# EAGLE design i2c_multiplexer_shield_v1 (EAGLE 6.5.0)
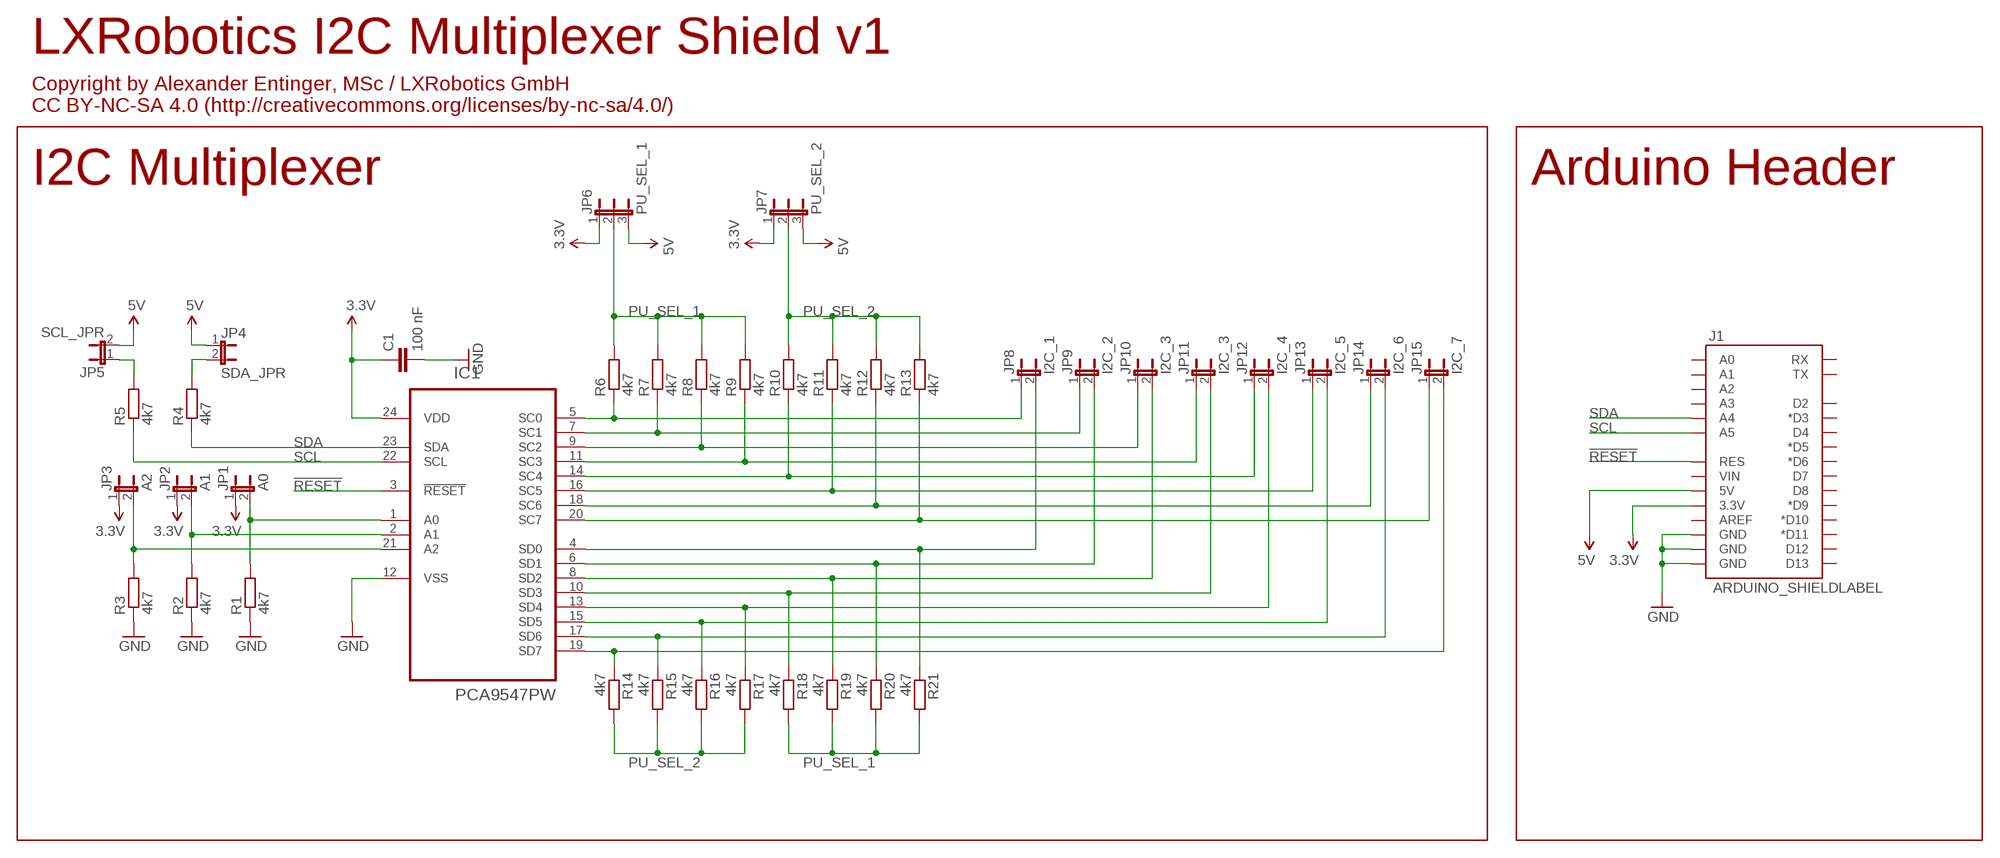
[diagram p0: schematic, sheet 1]

## Parts
C1  100 nF  C-EUC0805  [C0805]
IC1  PCA9547PW  [SOP65P640X110-24N]
J1  ARDUINO_SHIELDLABEL  [DUEMILANOVE_SHIELD]
JP1  A0  JP1E  [JP1]
JP2  A1  JP1E  [JP1]
JP3  A2  JP1E  [JP1]
JP4  SDA_JPR  JP1E  [JP1]
JP5  SCL_JPR  JP1E  [JP1]
JP6  PU_SEL_1  JP2E  [JP2]
JP7  PU_SEL_2  JP2E  [JP2]
JP8  I2C_1  JP1E  [JP1]
JP9  I2C_2  JP1E  [JP1]
JP10  I2C_3  JP1E  [JP1]
JP11  I2C_3  JP1E  [JP1]
JP12  I2C_4  JP1E  [JP1]
JP13  I2C_5  JP1E  [JP1]
JP14  I2C_6  JP1E  [JP1]
JP15  I2C_7  JP1E  [JP1]
R1  4k7  R-EU_R0805  [R0805]
R2  4k7  R-EU_R0805  [R0805]
R3  4k7  R-EU_R0805  [R0805]
R4  4k7  R-EU_R0805  [R0805]
R5  4k7  R-EU_R0805  [R0805]
R6  4k7  R-EU_R0805  [R0805]
R7  4k7  R-EU_R0805  [R0805]
R8  4k7  R-EU_R0805  [R0805]
R9  4k7  R-EU_R0805  [R0805]
R10  4k7  R-EU_R0805  [R0805]
R11  4k7  R-EU_R0805  [R0805]
R12  4k7  R-EU_R0805  [R0805]
R13  4k7  R-EU_R0805  [R0805]
R14  4k7  R-EU_R0805  [R0805]
R15  4k7  R-EU_R0805  [R0805]
R16  4k7  R-EU_R0805  [R0805]
R17  4k7  R-EU_R0805  [R0805]
R18  4k7  R-EU_R0805  [R0805]
R19  4k7  R-EU_R0805  [R0805]
R20  4k7  R-EU_R0805  [R0805]
R21  4k7  R-EU_R0805  [R0805]

## Nets
3.3V: C1.1 IC1.24(VDD) J1.3.3V JP1.1 JP2.1 JP3.1 JP6.1 JP7.1
5V: J1.5V JP4.1 JP5.2 JP6.3 JP7.3
!RESET: IC1.3(!RESET) J1.RES
GND: C1.2 IC1.12(VSS) J1.GND@0(GND) J1.GND@1(GND) J1.GND@2(GND) R1.1 R2.1 R3.1
N$1: IC1.1(A0) JP1.2 R1.2
N$2: IC1.2(A1) JP2.2 R2.2
N$3: IC1.21(A2) JP3.2 R3.2
N$4: JP5.1 R5.2
N$5: JP4.2 R4.2
N$6: IC1.5(SC0) JP8.1 R6.1
N$7: IC1.7(SC1) JP9.1 R7.1
N$8: IC1.9(SC2) JP10.1 R8.1
N$9: IC1.11(SC3) JP11.1 R9.1
N$10: IC1.14(SC4) JP12.1 R10.1
N$11: IC1.16(SC5) JP13.1 R11.1
N$12: IC1.18(SC6) JP14.1 R12.1
N$13: IC1.20(SC7) JP15.1 R13.1
N$16: IC1.4(SD0) JP8.2 R21.1
N$17: IC1.6(SD1) JP9.2 R20.1
N$18: IC1.8(SD2) JP10.2 R19.1
N$19: IC1.10(SD3) JP11.2 R18.1
N$20: IC1.13(SD4) JP12.2 R17.1
N$21: IC1.15(SD5) JP13.2 R16.1
N$22: IC1.17(SD6) JP14.2 R15.1
N$23: IC1.19(SD7) JP15.2 R14.1
PU_SEL_1: JP6.2 R6.2 R7.2 R8.2 R9.2 R18.2 R19.2 R20.2 R21.2
PU_SEL_2: JP7.2 R10.2 R11.2 R12.2 R13.2 R14.2 R15.2 R16.2 R17.2
SCL: IC1.22(SCL) J1.A5 R5.1
SDA: IC1.23(SDA) J1.A4 R4.1
Unconnected: J1.A0 J1.A1 J1.A2 J1.A3 J1.AREF J1.D2 J1.D3(*D3) J1.D4 J1.D5(*D5) J1.D6(*D6) J1.D7 J1.D8 J1.D9(*D9) J1.D10(*D10) J1.D11(*D11) J1.D12 J1.D13 J1.RX J1.TX J1.VIN

## Notes on the sheet
- LXRobotics I2C Multiplexer Shield v1
- Copyright by Alexander Entinger, MSc / LXRobotics GmbH 
  CC BY-NC-SA 4.0 (http://creativecommons.org/licenses/by-nc-sa/4.0/)
- I2C Multiplexer | Arduino Header

## Library data of the parts
C1 = resistor:C-EU: CAPACITOR, European symbol
IC1 = lxrobotics_ic:PCA9547PW: IC, 8-channel I2C-bus multiplexer with reset, 16TSSOP; MPN: PCA9547PW; OC_FARNELL: 2212121; OC_NEWARK: 55W4321; PACKAGE: TSSOP-24; SUPPLIER: NXP
J1 = SparkFun-Boards:ARDUINO_SHIELD: Arduino shield footprint
JP1-JP5 JP8-JP15 = jumper:JP1E: JUMPER
JP6 JP7 = jumper:JP2E: JUMPER
R1-R21 = resistor:R-EU_: RESISTOR, European symbol

## Board
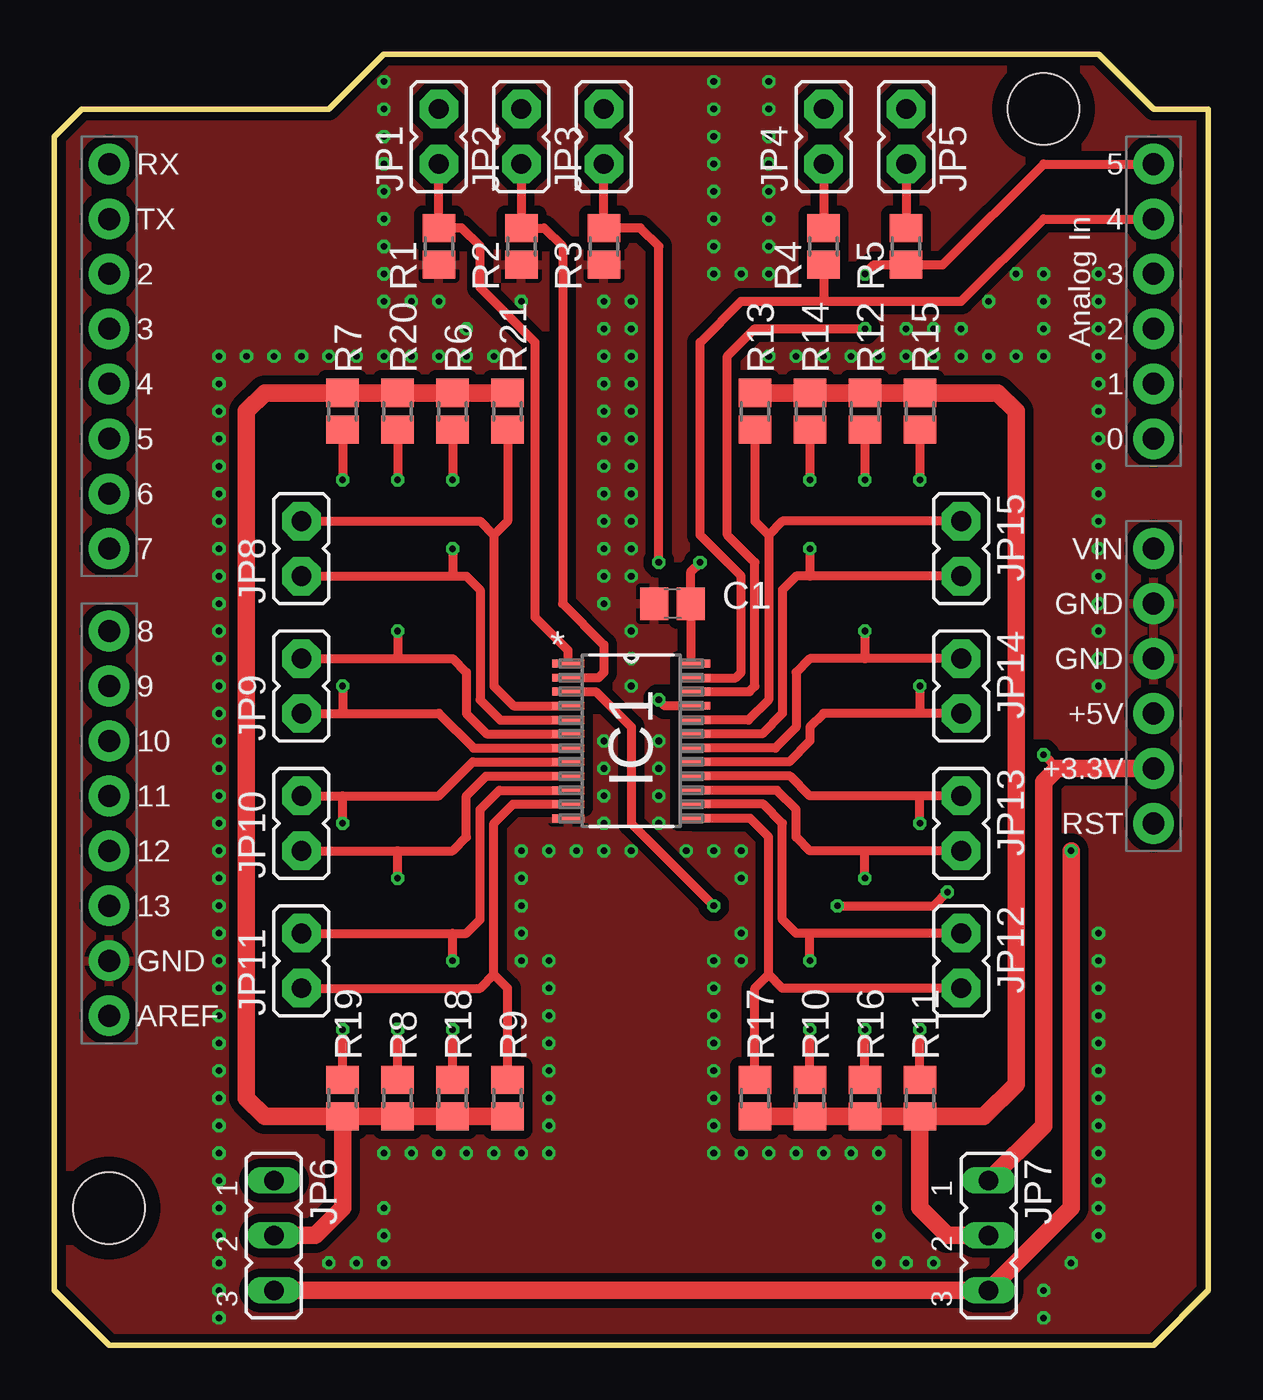
[diagram p1: board, top side]
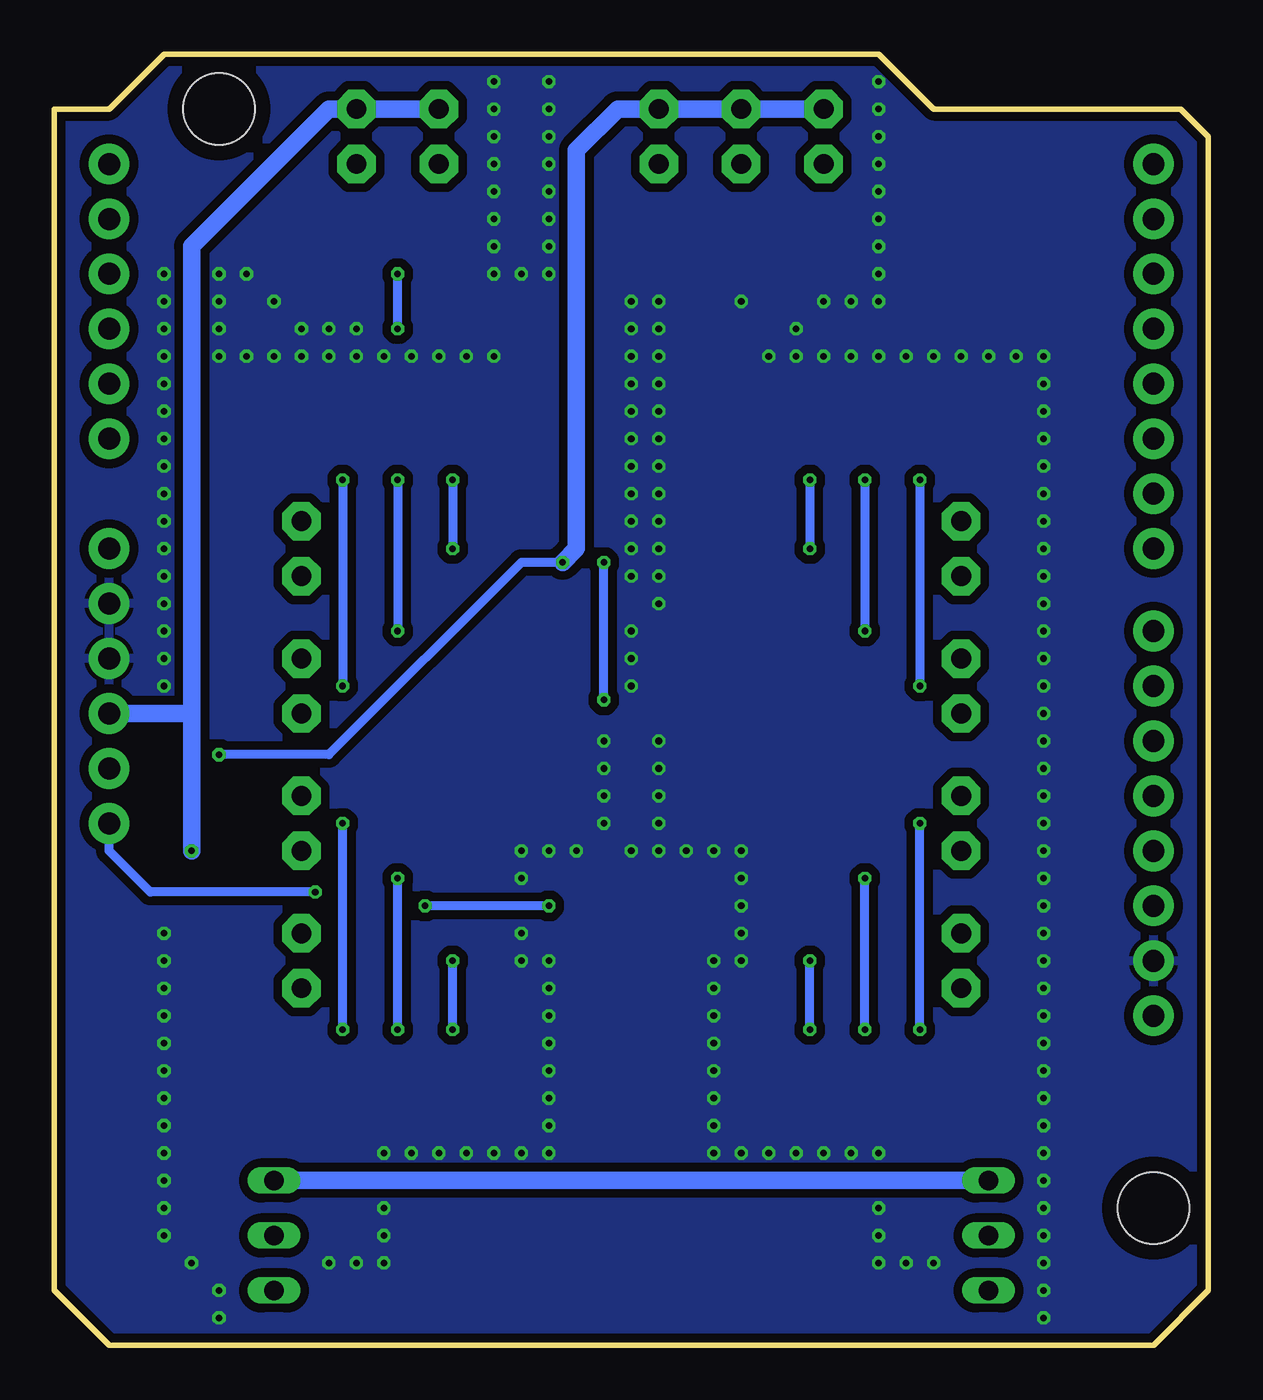
[diagram p2: board, bottom side, seen from below]

Size 53.34 x 59.69 mm. Coordinates in mm from the lower left corner, seen from the top.
Outline: 0,2.54 2.54,0 50.8,0 53.34,2.54 53.34,57.15 50.8,57.15 48.26,59.69 15.24,59.69 12.7,57.15 1.27,57.15 0,55.88 0,2.54
Copper layers (1*16): Top 0.035mm / dielectric 1.5mm / Bottom 0.035mm
Design rules "LeitOn - Standard-Eagle-DRU - 1- und  2-Lagen DK - deutsch - Rev 2.0": minimum track width 0.15mm, minimum drill 0.3mm, track to track 0.15mm, track to pad 0.15mm, pad to pad 0.15mm, via to via 0.15mm, smd to smd 0.15mm, copper to edge 0.3mm, drill to drill 0.3mm, minimum pad ring 0.15mm, minimum via ring 0.15mm, stop-mask expansion 0.075mm, vias tented up to drill 0mil, thermal gap 0.2mm

### Footprints (pad centres in the part's own frame; a part is rotated, then mirrored left to right if it is on the bottom)
C0805 = smd 1.3 x 1.5: 1 -0.85,0; 2 0.85,0
SOP65P640X110-24N = smd 1.473 x 0.356: 1 -2.921,3.581; 2 -2.921,2.921; 3 -2.921,2.286; 4 -2.921,1.626; 5 -2.921,0.965; 6 -2.921,0.33; 7 -2.921,-0.33; 8 -2.921,-0.965; 9 -2.921,-1.626; 10 -2.921,-2.286; 11 -2.921,-2.921; 12 -2.921,-3.581; 13 2.921,-3.581; 14 2.921,-2.921; 15 2.921,-2.286; 16 2.921,-1.626; 17 2.921,-0.965; 18 2.921,-0.33; 19 2.921,0.33; 20 2.921,0.965; 21 2.921,1.626; 22 2.921,2.286; 23 2.921,2.921; 24 2.921,3.581
DUEMILANOVE_SHIELD = drill 1.016 pad 1.88: 3.3V 50.8,26.67; 5V 50.8,29.21; A0 50.8,41.91; A1 50.8,44.45; A2 50.8,46.99; A3 50.8,49.53; A4 50.8,52.07; A5 50.8,54.61; AREF 2.54,15.24; D2 2.54,49.53; D3 2.54,46.99; D4 2.54,44.45; D5 2.54,41.91; D6 2.54,39.37; D7 2.54,36.83; D8 2.54,33.02; D9 2.54,30.48; D10 2.54,27.94; D11 2.54,25.4; D12 2.54,22.86; D13 2.54,20.32; GND@0 50.8,31.75; GND@1 50.8,34.29; GND@2 2.54,17.78; RES 50.8,24.13; RX 2.54,54.61; TX 2.54,52.07; VIN 50.8,36.83 | hole 3.302: 45.72,57.15; 2.54,6.35
JP1 = drill 0.914 pad 1.778 octagon: 1 0,-1.27; 2 0,1.27
JP2 = drill 0.914 long: 1 -2.54,0; 2 0,0; 3 2.54,0
R0805 = smd 1.3 x 1.5: 1 -0.85,0; 2 0.85,0

### Placement (x,y rotation side)
C1  28.57,34.29 180 top
IC1  26.67,27.94 0 top
J1  0,0 0 top
JP1  17.78,55.88 180 top
JP2  21.59,55.88 180 top
JP3  25.4,55.88 180 top
JP4  35.56,55.88 180 top
JP5  39.37,55.88 0 top
JP6  10.16,5.08 270 top
JP7  43.18,5.08 270 top
JP8  11.43,36.83 0 top
JP9  11.43,30.48 0 top
JP10  11.43,24.13 0 top
JP11  11.43,17.78 0 top
JP12  41.91,17.78 180 top
JP13  41.91,24.13 180 top
JP14  41.91,30.48 180 top
JP15  41.91,36.83 180 top
R1  17.78,50.8 90 top
R2  21.59,50.8 90 top
R3  25.4,50.8 90 top
R4  35.56,50.8 90 top
R5  39.37,50.8 90 top
R6  18.41,43.18 90 top
R7  13.34,43.18 90 top
R8  15.88,11.43 270 top
R9  20.95,11.43 270 top
R10  34.92,11.43 270 top
R11  40.01,11.43 270 top
R12  37.47,43.18 90 top
R13  32.38,43.18 90 top
R14  34.92,43.18 90 top
R15  40.01,43.18 90 top
R16  37.47,11.43 270 top
R17  32.38,11.43 270 top
R18  18.41,11.43 270 top
R19  13.34,11.43 270 top
R20  15.88,43.18 90 top
R21  20.95,43.18 90 top

### Tracks (layer width: path | path; a pad name or v marks a point on that pad's centre or on a via)
3.3V  (via drill 0.3)
  Top 0.406: v45.72,27.3 46.35,26.67 | IC1.24 29.43,31.52 C1.1 29.43,35.77 v29.84,36.2
  Top 0.813: J1.3.3V 46.35,26.67 45.72,26.04 45.72,10.16 JP7.1
  Bottom 0.406: v45.72,27.3 40.64,27.3 31.75,36.2 v29.84,36.2
  Bottom 0.813: JP6.1 JP7.1 | JP1.1 JP2.1 JP3.1 27.3,57.15 29.21,55.24 29.21,36.83 v29.84,36.2
5V  (via drill 0.3)
  Top 0.813: JP6.3 JP7.3 46.99,6.35 v46.99,22.86
  Bottom 0.813: JP5.2 JP4.1 40.64,57.15 46.99,50.8 46.99,29.21 | 46.99,29.21 J1.5V | 46.99,29.21 v46.99,22.86
!RESET  (via drill 0.3)
  Top 0.406: IC1.3 25.02,30.23 26.67,28.57 26.67,24.13 v30.48,20.32 | v36.2,20.32 40.64,20.32 v41.27,20.95
  Bottom 0.406: v30.48,20.32 v36.2,20.32 | v41.27,20.95 48.9,20.95 50.8,22.86 J1.RES
GND  (via drill 0.3)
  other vias: 21.59,22.86 22.86,22.86 24.13,22.86 25.4,22.86 26.67,22.86 29.21,22.86 30.48,22.86 31.75,22.86 31.75,21.59 21.59,21.59 21.59,20.32 21.59,19.05 21.59,17.78 22.86,17.78 22.86,15.24 22.86,16.51 22.86,13.97 22.86,12.7 22.86,11.43 22.86,10.16 22.86,8.89 31.75,19.05 31.75,17.78 30.48,17.78 30.48,16.51 30.48,15.24 30.48,13.97 30.48,12.7 30.48,11.43 30.48,10.16 30.48,8.89 25.4,25.4 25.4,24.13 25.4,26.67 25.4,27.94 27.94,27.94 27.94,26.67 27.94,25.4 27.94,24.13 26.67,30.48 26.67,31.75 26.67,33.02 25.4,34.29 25.4,35.56 25.4,36.83 25.4,38.1 26.67,38.1 26.67,36.83 26.67,35.56 26.67,39.37 25.4,39.37 25.4,40.64 26.67,40.64 26.67,41.91 25.4,41.91 25.4,43.18 25.4,44.45 25.4,45.72 26.67,45.72 26.67,44.45 26.67,43.18 26.67,46.99 25.4,46.99 25.4,48.26 26.67,48.26 21.59,48.26 20.32,45.72 19.05,46.99 17.78,48.26 16.51,48.26 15.24,48.26 15.24,49.53 15.24,50.8 15.24,52.07 15.24,53.34 15.24,54.61 15.24,55.88 15.24,57.15 15.24,58.42 19.05,45.72 13.97,45.72 17.78,45.72 16.51,45.72 15.24,45.72 12.7,45.72 11.43,45.72 10.16,45.72 8.89,45.72 7.62,45.72 7.62,44.45 7.62,43.18 7.62,41.91 7.62,40.64 7.62,39.37 7.62,38.1 7.62,36.83 7.62,35.56 7.62,34.29 7.62,33.02 7.62,31.75 7.62,30.48 7.62,29.21 7.62,27.94 7.62,26.67 7.62,25.4 7.62,24.13 7.62,22.86 7.62,21.59 7.62,20.32 7.62,19.05 7.62,17.78 7.62,16.51 7.62,15.24 7.62,13.97 7.62,12.7 7.62,11.43 7.62,10.16 7.62,8.89 7.62,7.62 7.62,6.35 7.62,5.08 7.62,3.81 7.62,2.54 7.62,1.27 30.48,58.42 30.48,57.15 30.48,55.88 30.48,54.61 30.48,53.34 30.48,52.07 30.48,50.8 30.48,49.53 31.75,49.53 33.02,49.53 33.02,50.8 33.02,52.07 33.02,53.34 33.02,54.61 33.02,55.88 33.02,57.15 33.02,58.42 39.37,46.99 40.64,46.99 41.91,46.99 43.18,48.26 44.45,49.53 45.72,49.53 45.72,48.26 45.72,46.99 45.72,45.72 44.45,45.72 43.18,45.72 41.91,45.72 40.64,45.72 39.37,45.72 38.1,45.72 36.83,45.72 35.56,45.72 34.29,45.72 33.02,45.72 21.59,8.89 20.32,8.89 19.05,8.89 17.78,8.89 16.51,8.89 15.24,8.89 31.75,8.89 33.02,8.89 34.29,8.89 35.56,8.89 36.83,8.89 38.1,8.89 48.26,49.53 48.26,48.26 48.26,46.99 48.26,45.72 48.26,44.45 48.26,43.18 48.26,41.91 48.26,40.64 48.26,39.37 48.26,38.1 48.26,36.83 48.26,35.56 48.26,34.29 48.26,33.02 48.26,31.75 48.26,30.48 48.26,19.05 48.26,17.78 48.26,16.51 48.26,15.24 48.26,13.97 48.26,12.7 48.26,11.43 48.26,10.16 48.26,8.89 48.26,7.62 48.26,6.35 48.26,5.08 46.99,3.81 45.72,2.54 45.72,1.27 15.24,6.35 15.24,5.08 15.24,3.81 38.1,6.35 38.1,5.08 38.1,3.81 39.37,3.81 13.97,3.81 12.7,3.81 40.64,3.81
  pour Bottom (isolate 0.406): 0.64,2.54 2.54,0.64 50.8,0.64 52.7,2.54 52.7,56.52 50.8,56.52 48.26,59.05 15.24,59.05 12.7,56.52 1.27,56.52 0.64,55.88
  pour Top (isolate 0.406): 0.64,2.54 2.54,0.64 50.8,0.64 52.7,2.54 52.7,56.52 50.8,56.52 48.26,59.05 15.24,59.05 12.7,56.52 1.27,56.52 0.64,55.88
N$1
  Top 0.406: JP1.2 R1.2 18.84,51.65 19.68,50.8 19.68,48.9 22.23,46.35 22.23,33.66 23.75,32.13 IC1.1
N$2
  Top 0.406: JP2.2 R2.2 22.64,51.65 23.5,50.8 23.5,34.29 25.4,32.38 25.4,31.11 25.15,30.86 IC1.2
N$3  (via drill 0.3)
  Top 0.406: JP3.2 R3.2 27.09,51.65 27.94,50.8 v27.94,36.2 | IC1.21 28.22,29.57 v27.94,29.84
  Bottom 0.406: v27.94,29.84 v27.94,36.2
N$4
  Top 0.406: JP5.1 R5.2
N$5
  Top 0.406: JP4.2 R4.2
N$6  (via drill 0.3)
  Top 0.406: JP8.1 18.41,35.56 | 18.41,35.56 19.05,35.56 19.68,34.92 19.68,29.84 20.62,28.91 IC1.5 | R6.1 v18.41,40.01 | v18.41,36.83 18.41,35.56
  Bottom 0.406: v18.41,40.01 v18.41,36.83
N$7  (via drill 0.3)
  Top 0.406: JP9.1 13.34,29.21 | 13.34,29.21 17.78,29.21 19.38,27.61 IC1.7 | R7.1 v13.34,40.01 | v13.34,30.48 13.34,29.21
  Bottom 0.406: v13.34,40.01 v13.34,30.48
N$8  (via drill 0.3)
  Top 0.406: JP10.1 15.88,22.86 | 15.88,22.86 18.41,22.86 19.05,23.5 19.05,25.4 19.96,26.31 IC1.9 | R8.1 v15.88,14.61 | v15.88,21.59 15.88,22.86
  Bottom 0.406: v15.88,14.61 v15.88,21.59
N$9
  Top 0.406: JP11.1 19.68,16.51 20.32,17.14 | 20.32,17.14 20.32,24.13 21.21,25.02 IC1.11 | R9.1 20.95,16.51 20.32,17.14
N$10  (via drill 0.3)
  Top 0.406: JP12.1 34.92,19.05 | 34.92,19.05 34.29,19.05 33.66,19.68 33.66,24.13 32.77,25.02 IC1.14 | R10.1 v34.92,14.61 | v34.92,17.78 34.92,19.05
  Bottom 0.406: v34.92,14.61 v34.92,17.78
N$11  (via drill 0.3)
  Top 0.406: JP13.1 40.01,25.4 | 40.01,25.4 34.92,25.4 34.01,26.31 IC1.16 | R11.1 v40.01,14.61 | v40.01,24.13 40.01,25.4
  Bottom 0.406: v40.01,14.61 v40.01,24.13
N$12  (via drill 0.3)
  Top 0.406: JP14.1 37.47,31.75 | 37.47,31.75 34.92,31.75 34.29,31.11 34.29,28.57 33.33,27.61 IC1.18 | R12.1 v37.47,40.01 | v37.47,33.02 37.47,31.75
  Bottom 0.406: v37.47,40.01 v37.47,33.02
N$13
  Top 0.406: JP15.1 33.66,38.1 33.02,37.47 | 33.02,37.47 33.02,29.84 32.08,28.91 IC1.20 | R13.1 32.38,38.1 33.02,37.47
N$16
  Top 0.406: JP8.2 19.68,38.1 20.32,37.47 | 20.32,37.47 20.32,30.48 21.23,29.57 IC1.4 | R21.1 20.95,38.1 20.32,37.47
N$17  (via drill 0.3)
  Top 0.406: JP9.2 15.88,31.75 | 15.88,31.75 18.41,31.75 19.05,31.11 19.05,29.21 19.99,28.27 IC1.6 | R20.1 v15.88,40.01 | v15.88,33.02 15.88,31.75
  Bottom 0.406: v15.88,40.01 v15.88,33.02
N$18  (via drill 0.3)
  Top 0.406: JP10.2 13.34,25.4 | 13.34,25.4 17.78,25.4 19.36,26.98 IC1.8 | R19.1 v13.34,14.61 | v13.34,24.13 13.34,25.4
  Bottom 0.406: v13.34,14.61 v13.34,24.13
N$19  (via drill 0.3)
  Top 0.406: JP11.2 18.41,19.05 | 18.41,19.05 19.05,19.05 19.68,19.68 19.68,24.77 20.57,25.65 IC1.10 | R18.1 v18.41,14.61 | v18.41,17.78 18.41,19.05
  Bottom 0.406: v18.41,14.61 v18.41,17.78
N$20
  Top 0.406: JP12.2 33.66,16.51 33.02,17.14 | 33.02,17.14 33.02,23.5 32.16,24.36 IC1.13 | R17.1 32.38,16.51 33.02,17.14
N$21  (via drill 0.3)
  Top 0.406: JP13.2 37.47,22.86 | 37.47,22.86 34.92,22.86 34.29,23.5 34.29,24.77 33.4,25.65 IC1.15 | R16.1 v37.47,14.61 | v37.47,21.59 37.47,22.86
  Bottom 0.406: v37.47,14.61 v37.47,21.59
N$22  (via drill 0.3)
  Top 0.406: JP14.2 40.01,29.21 | 40.01,29.21 35.56,29.21 34.92,28.57 34.92,27.94 33.96,26.98 IC1.17 | R15.1 v40.01,40.01 | v40.01,30.48 40.01,29.21
  Bottom 0.406: v40.01,40.01 v40.01,30.48
N$23  (via drill 0.3)
  Top 0.406: JP15.2 34.92,35.56 | 34.92,35.56 34.29,35.56 33.66,34.92 33.66,29.21 32.72,28.27 IC1.19 | R14.1 v34.92,40.01 | v34.92,36.83 34.92,35.56
  Bottom 0.406: v34.92,40.01 v34.92,36.83
PU_SEL_1
  Top 0.813: R7.2 R20.2 R6.2 R21.2 9.74,44.03 8.89,43.18 8.89,11.43 9.74,10.58 R19.2 | R19.2 R8.2 R18.2 R9.2 | JP6.2 12.06,5.08 13.34,6.35 R19.2
PU_SEL_2
  Top 0.813: R13.2 R14.2 R12.2 R15.2 43.6,44.03 44.45,43.18 44.45,12.06 42.97,10.58 R11.2 | R17.2 R10.2 R16.2 R11.2 | JP7.2 41.27,5.08 40.01,6.35 R11.2
SCL  (via drill 0.3)
  Top 0.406: J1.A5 45.72,54.61 41.06,49.95 R5.1 37.88,49.95 v37.47,49.53 | IC1.22 32.13,30.23 32.38,30.48 32.38,36.2 31.11,37.47 31.11,45.72 32.38,46.99 v37.47,46.99
  Bottom 0.406: v37.47,46.99 v37.47,49.53
SDA
  Top 0.406: R4.1 35.56,48.26 | 35.56,48.26 41.91,48.26 45.72,52.07 J1.A4 | IC1.23 31.5,30.86 31.75,31.11 31.75,35.56 29.84,37.47 29.84,46.35 31.75,48.26 35.56,48.26